# EAGLE design BC840M (EAGLE 9.6.2)

## Sheet 1 of 3
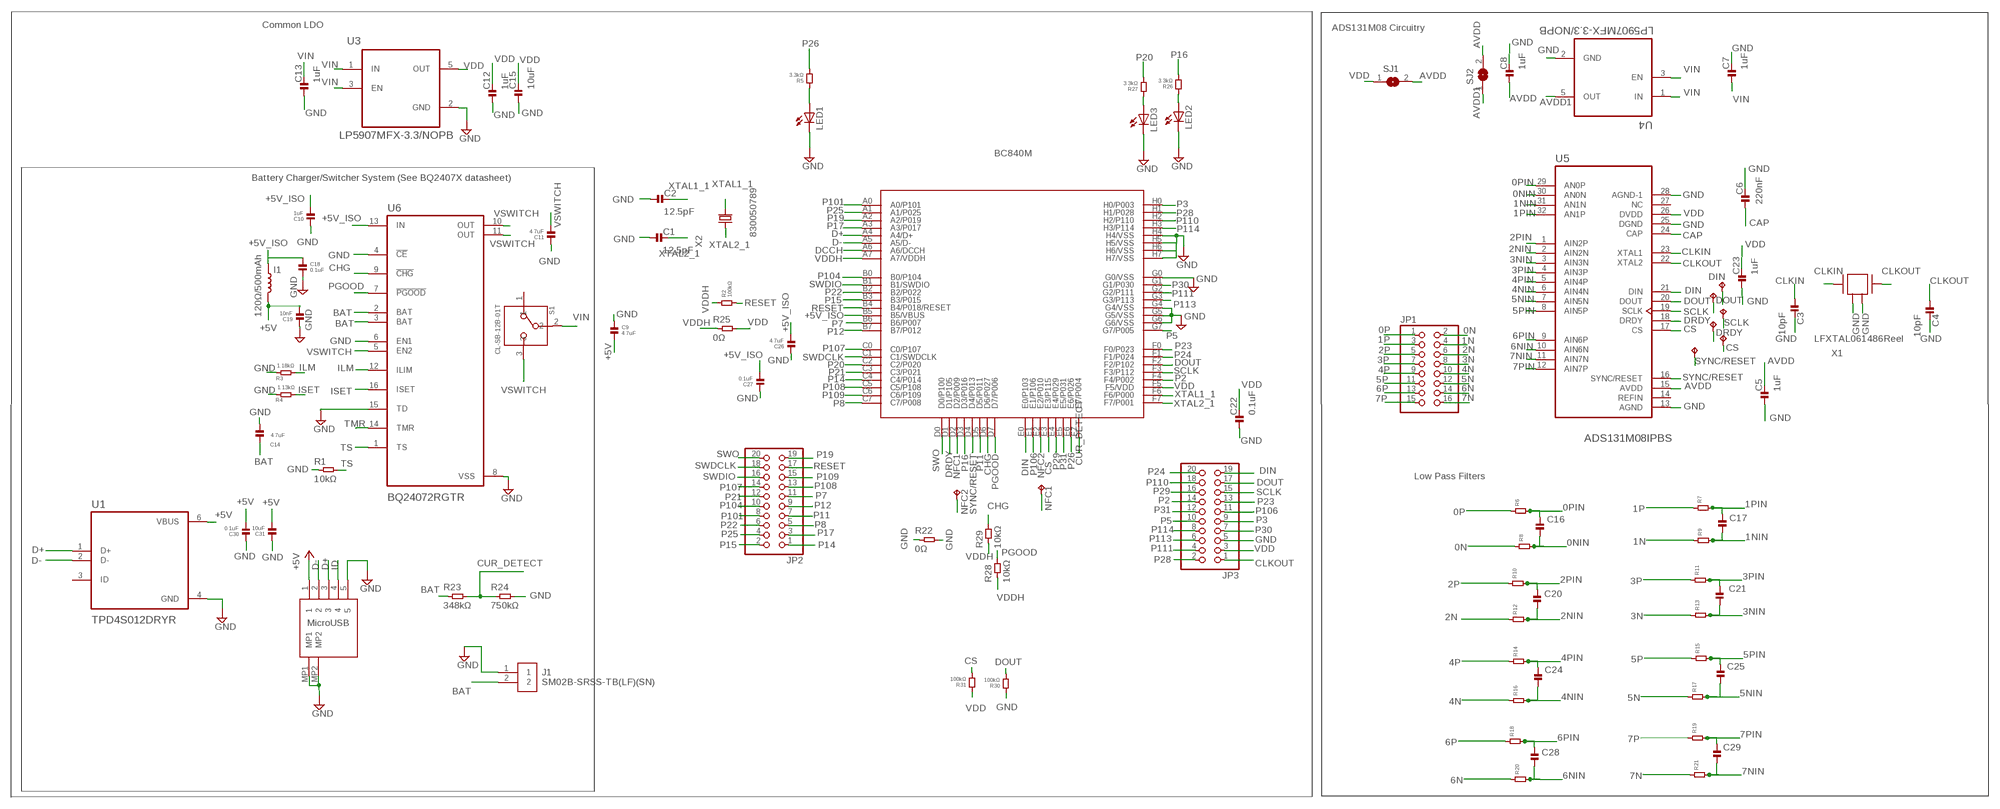
[diagram p0: schematic, sheet 1]

### Parts
C1  12.5pF  CAPACITOR.0201  [0201]
C2  12.5pF  CAPACITOR.0201  [0201]
C3  10pF  CAPACITOR.0201  [0201]
C4  10pF  CAPACITOR.0201  [0201]
C5  1uF  CAPACITOR.0201  [0201]
C6  220nF  CAPACITOR.0201  [0201]
C7  1uF  CAPACITOR.0201  [0201]
C8  1uF  CAPACITOR.0201  [0201]
C9  4.7uF  CAPACITOR.0201  [0201]
C10  1uF  CAPACITOR.0201  [0201]
C11  4.7uF  CAPACITOR.0201  [0201]
C12  1uF  CAPACITOR.0201  [0201]
C13  1uF  CAPACITOR.0201  [0201]
C14  4.7uF  CAPACITOR.0201  [0201]
C15  10uF  CAPACITOR.0402  [0402]
C16  100pF  CAPACITOR.0603  [0603]
C17  100pF  CAPACITOR.0603  [0603]
C18  0.1uF  CAPACITOR.0201  [0201]
C19  10nF  CAPACITOR.0201  [0201]
C20  100pF  CAPACITOR.0603  [0603]
C21  100pF  CAPACITOR.0603  [0603]
C22  0.1uF  CAPACITOR.0201  [0201]
C23  1uF  CAPACITOR.0201  [0201]
C24  100pF  CAPACITOR.0603  [0603]
C25  100pF  CAPACITOR.0603  [0603]
C26  4.7uF  CAPACITOR.0201  [0201]
C27  0.1uF  CAPACITOR.0201  [0201]
C28  100pF  CAPACITOR.0603  [0603]
C29  100pF  CAPACITOR.0603  [0603]
C30  0.1uF  CAPACITOR.0201  [0201]
C31  10uF  CAPACITOR.0402  [0402]
CS  TPTP07R  [TP07R]
DIN  TPTP07R  [TP07R]
DOUT  TPTP07R  [TP07R]
DRDY  TPTP07R  [TP07R]
I1  120Ω/500mAh  12NH-0402  [0402_COILCRAFT]
J1  SM02B-SRSS-TB(LF)(SN)  [SM02B-SRSS-TB(LF)(SN)]
JP1  PINHD-2X8SMT  [2X08_SMT]
JP2  PINHD-2X10SMT  [2X10_SMT]
JP3  PINHD-2X10SMT  [2X10_SMT]
LED1  LEDCHIPLED_0603  [CHIPLED_0603]
LED2  LEDCHIPLED_0603  [CHIPLED_0603]
LED3  LEDCHIPLED_0603  [CHIPLED_0603]
NFC1  TPTP14SQ  [TP14SQ]
NFC2  TPTP14SQ  [TP14SQ]
R1  10kΩ  RESISTOR.0201  [0201]
R2  100kΩ  RESISTOR.0201  [0201]
R3  1.18kΩ  RESISTOR.0603  [0603]
R4  1.13kΩ  RESISTOR.0603  [0603]
R5  3.3kΩ  RESISTOR.0201  [0201]
R6  1MOhm  RESISTOR.0603  [0603]
R7  1MOhm  RESISTOR.0603  [0603]
R8  1MOhm  RESISTOR.0603  [0603]
R9  1MOhm  RESISTOR.0603  [0603]
R10  1MOhm  RESISTOR.0603  [0603]
R11  1MOhm  RESISTOR.0603  [0603]
R12  1MOhm  RESISTOR.0603  [0603]
R13  1MOhm  RESISTOR.0603  [0603]
R14  1MOhm  RESISTOR.0603  [0603]
R15  1MOhm  RESISTOR.0603  [0603]
R16  1MOhm  RESISTOR.0603  [0603]
R17  1MOhm  RESISTOR.0603  [0603]
R18  1MOhm  RESISTOR.0603  [0603]
R19  1MOhm  RESISTOR.0603  [0603]
R20  1MOhm  RESISTOR.0603  [0603]
R21  1MOhm  RESISTOR.0603  [0603]
R22  0Ω  RESISTOR.0805  [0805]
R23  348kΩ  RESISTOR.0603  [0603]
R24  750kΩ  RESISTOR.0603  [0603]
R25  0Ω  RESISTOR.0805  [0805]
R26  3.3kΩ  RESISTOR.0201  [0201]
R27  3.3kΩ  RESISTOR.0201  [0201]
R28  10kΩ  RESISTOR.0402  [0402]
R29  10kΩ  RESISTOR.0402  [0402]
R30  100kΩ  RESISTOR.0402  [0402]
R31  100kΩ  RESISTOR.0402  [0402]
S1  CL-SB-12B-01T  [CL-SB-12B]
SCLK  TPTP07R  [TP07R]
SJ1  SJ  [SJ]
SJ2  SJ  [SJ]
SYNC  TPTP07R  [TP07R]
U1  TPD4S012DRYR  [PSON50P145X100X60-6N]
U2  BC840M  [BC840M]
U3  LP5907MFX-3.3/NOPB  [SOT95P280X145-5N]
U4  LP5907MFX-3.3/NOPB  [SOT95P280X145-5N]
U5  ADS131M08IPBS  [QFP50P700X700X120-32N]
U6  BQ24072RGTR  [QFN50P300X300X100-17N]
U7  DX4R005JJ2R1800  [DX4R005JJ2R1800]
X1  ABM3B-8.000MHZ-B2-T  [ABM3B-8.000MHZ-B2-T]
X2  FC-12M  [FC-12M]

### Nets
0N: JP1.2 R8.1
0NIN: C16.2 R8.2 U5.30(AN0N)
0P: JP1.1 R6.1
0PIN: C16.1 R6.2 U5.29(AN0P)
1N: JP1.4 R9.1
1NIN: C17.2 R9.2 U5.31(AN1N)
1P: JP1.3 R7.1
1PIN: C17.1 R7.2 U5.32(AN1P)
2N: JP1.6 R12.1
2NIN: C20.2 R12.2 U5.2(AIN2N)
2P: JP1.5 R10.1
2PIN: C20.1 R10.2 U5.1(AIN2P)
3N: JP1.8 R13.1
3NIN: C21.2 R13.2 U5.3(AIN3N)
3P: JP1.7 R11.1
3PIN: C21.1 R11.2 U5.4(AIN3P)
4N: JP1.10 R16.1
4NIN: C24.2 R16.2 U5.6(AIN4N)
4P: JP1.9 R14.1
4PIN: C24.1 R14.2 U5.5(AIN4P)
5N: JP1.12 R17.1
5NIN: C25.2 R17.2 U5.7(AIN5N)
5P: JP1.11 R15.1
5PIN: C25.1 R15.2 U5.8(AIN5P)
6N: JP1.14 R20.1
6NIN: C28.2 R20.2 U5.10(AIN6N)
6P: JP1.13 R18.1
6PIN: C28.1 R18.2 U5.9(AIN6P)
7N: JP1.16 R21.1
7NIN: C29.2 R21.2 U5.11(AIN7N)
7P: JP1.15 R19.1
7PIN: C29.1 R19.2 U5.12(AIN7P)
+5V: C9.2 C19.2 C30.2 C31.2 I1.P$2 U1.6(VBUS) U7.1
+5V_ISO: C10.2 C18.1 C26.2 C27.2 I1.P$1 U2.B5(B5/VBUS) U6.13(IN)
AVDD: C5.2 C8.1 SJ1.2 SJ2.2 U5.15(AVDD)
AVDD1: SJ2.1 U4.5(OUT)
BAT: C14.2 J1.2 R23.1 U6.2(BAT) U6.3(BAT)
CAP: C6.1 U5.24(CAP)
CHG: R29.2 U2.D6(D6/P027) U6.9(!CHG)
CLKIN: C3.1 U5.23(XTAL1) X1.1
CLKOUT: C4.1 JP3.1 U5.22(XTAL2) X1.3
CS: CS.TP R31.1 U2.E3(E3/P115) U5.17(CS)
CUR_DETECT: R23.2 R24.1 U2.E7(E7/P004)
D+: U1.1(D+) U2.A4(A4/D+) U7.3
D-: U1.2(D-) U2.A5(A5/D-) U7.2
DCCH: U2.A6(A6/DCCH)
DIN: DIN.TP JP3.19 U2.E0(E0/P103) U5.21(DIN)
DOUT: DOUT.TP JP3.17 R30.1 U2.F2(F2/P102) U5.20(DOUT)
DRDY: DRDY.TP U2.D1(D1/P105) U5.18(DRDY)
GND: C1.1 C2.1 C3.2 C4.2 C5.1 C6.2 C7.2 C8.2 C9.1 C10.1 C11.1 C12.1 C13.1 C14.1 C15.1 C18.2 C19.1 C22.1 C23.1 C26.1 C27.1 C30.1 C31.1 J1.1 JP3.5 LED1.C LED2.C LED3.C R1.1 R3.1 R4.1 R22.1 R22.2 R24.2 R30.2 U1.4(GND) U2.G0(G0/VSS) U2.G4(G4/VSS) U2.G5(G5/VSS) U2.G6(G6/VSS) U2.H4(H4/VSS) U2.H5(H5/VSS) U2.H6(H6/VSS) U2.H7(H7/VSS) U3.2(GND) U4.2(GND) U5.13(AGND) U5.25(DGND) U5.28(AGND-1) U6.4(!CE) U6.6(EN1) U6.8(VSS) U6.15(TD) U7.5 U7.MP1 U7.MP2 X1.2 X1.4
ID: U7.4
ILM: R3.2 U6.12(ILIM)
ISET: R4.2 U6.16(ISET)
LED1: LED1.A R5.2
LED2: LED2.A R26.2
LED3: LED3.A R27.2
NFC1: NFC2.TP U2.D2(D2/P009)
NFC2: NFC1.TP U2.E2(E2/P010)
P2: JP3.14 U2.F4(F4/P002)
P3: JP3.9 U2.H0(H0/P003)
P5: JP3.10 U2.G7(G7/P005)
P7: JP2.11 U2.B6(B6/P007)
P8: JP2.5 U2.C7(C7/P008)
P11: JP2.7 U2.D5(D5/P011)
P12: JP2.9 U2.B7(B7/P012)
P14: JP2.1 U2.C4(C4/P014)
P15: JP2.2 U2.B3(B3/P015)
P16: R26.1 U2.D3(D3/P016)
P17: JP2.3 U2.A3(A3/P017)
P19: JP2.19 U2.A2(A2/P019)
P20: R27.1 U2.C2(C2/P020)
P21: JP2.12 U2.C3(C3/P021)
P22: JP2.6 U2.B2(B2/P022)
P23: JP3.13 U2.F0(F0/P023)
P24: JP3.20 U2.F1(F1/P024)
P25: JP2.4 U2.A1(A1/P025)
P26: R5.1 U2.E6(E6/P026)
P28: JP3.2 U2.H1(H1/P028)
P29: JP3.16 U2.E4(E4/P029)
P30: JP3.7 U2.G1(G1/P030)
P31: JP3.12 U2.E5(E5/P031)
P101: JP2.8 U2.A0(A0/P101)
P104: JP2.10 U2.B0(B0/P104)
P106: JP3.11 U2.E1(E1/P106)
P107: JP2.14 U2.C0(C0/P107)
P108: JP2.13 U2.C5(C5/P108)
P109: JP2.15 U2.C6(C6/P109)
P110: JP3.18 U2.H2(H2/P110)
P111: JP3.4 U2.G2(G2/P111)
P113: JP3.6 U2.G3(G3/P113)
P114: JP3.8 U2.H3(H3/P114)
PGOOD: R28.2 U2.D7(D7/P006) U6.7(!PGOOD)
RESET: JP2.17 R2.1 U2.B4(B4/P018/RESET)
SCLK: JP3.15 SCLK.TP U2.F3(F3/P112) U5.19(SCLK)
SWDCLK: JP2.18 U2.C1(C1/SWDCLK)
SWDIO: JP2.16 U2.B1(B1/SWDIO)
SWO: JP2.20 U2.D0(D0/P100)
SYNC/RESET: SYNC.TP U2.D4(D4/P013) U5.16(SYNC/RESET)
TMR: U6.14(TMR)
TS: R1.2 U6.1(TS)
VDD: C12.2 C15.2 C22.2 C23.2 JP3.3 R25.2 R31.2 SJ1.1 U2.F5(F5/VDD) U3.5(OUT) U5.26(DVDD)
VDDH: R2.2 R25.1 R28.1 R29.1 U2.A7(A7/VDDH)
VIN: C7.1 C13.2 S1.2 U3.1(IN) U3.3(EN) U4.1(IN) U4.3(EN)
VSWITCH: C11.2 S1.3 U6.5(EN2) U6.10(OUT) U6.11(OUT)
XTAL1_1: C2.2 U2.F6(F6/P000) X2.2
XTAL2_1: C1.2 U2.F7(F7/P001) X2.1
Unconnected: S1.1 U1.3(ID) U5.14(REFIN) U5.27(NC)

### Notes on the sheet
- Common LDO
- ADS131M08 Circuitry
- BC840M
- Battery Charger/Switcher System (See BQ2407X datasheet)
- 830050789
- LFXTAL061486Reel
- Low Pass Filters
- MicroUSB

## Sheet 2 of 3

## Sheet 3 of 3

## Library data of the parts
C1-C31 = standardparts:CAPACITOR
CS DIN DOUT DRDY NFC1 NFC2 SCLK SYNC = testpad:TP: Test pad
I1 = spkfncoils:12NH; MOUSER_PART: 994-0402HP-12NXGLU; PROD_ID: NDUC-15271; VALUE: 12nH
J1 = SM02B-SRSS-TB_LF__SN_:SM02B-SRSS-TB(LF)(SN): JST (JAPAN SOLDERLESS TERMINALS) - SM02B-SRSS-TB (LF)(SN) - HEADER, R/A, 2WAY Source: Datasheet <http://www.jst-mfg.com/product/pdf/eng/eSH.pdf> Check prices <https://pricing.snapeda.com/parts/SM02B-SRSS-TB%28LF%29%28SN%29/JST%20Sales/view-part?ref=eda>; AVAILABILITY: In Stock; DESCRIPTION: Connector Header Surface Mount, Right Angle 2 position 0.039 (1.00mm); MF: JST Sales; MP: SM02B-SRSS-TB(LF)(SN); PACKAGE: None; PRICE: None
JP1 = pinhead+:PINHD-2X8: PIN HEADER
JP2 JP3 = pinhead+:PINHD-2X10: PIN HEADER
LED1-LED3 = adafruit:LED: LED OSRAM: - CHIPLED LG R971, LG N971, LY N971, LG Q971, LY Q971, LO R971, LY R971 LH N974, LH R974 LS Q976, LO Q976, LY Q976 LO Q996 - Hyper CHIPLED LW Q18S LB Q993, LB Q99A, LB R99A - SideLED LS A670, LO A670, LY A670, LG A670, LP A670 LB A673, LV A673, LT A673, LW A673 LH A674 LY A675 LS A676, LA A676, LO A676, LY A676, LW A676 LS A679, LY A679, LG A679 - Hyper Micro SIDELED® LS Y876, LA Y876, LO Y876, LY Y876 LT Y87S - SmartLED LW L88C, LW L88S LB L89C, LB L89S, LG L890 LS L89K, LO L89K, LY L89K LS L896, LA L896, LO L896, LY L896 - TOPLED LS T670, LO T670, LY T670, LG T670, LP T670 LSG T670, LSP T670, LSY T670, LOP T670, LYG T670 LG T671, LOG T671, LSG T671 LB T673, LV T673, LT T673, LW T673 LH T674 LS T676, LA T676, LO T676, LY T676, LB T676, LH T676, LSB T676, LW T676 LB T67C, LV T67C, LT T67C, LS T67K, LO T67K, LY T67K, LW E67C LS E67B, LA E67B, LO E67B, LY E67B, LB E67C, LV E67C, LT E67C LW T67C LS T679, LY T679, LG T679 LS T770, LO T770, LY T770, LG T770, LP T770 LB T773, LV T773, LT T773, LW T773 LH T774 LS E675, LA E675, LY E675, LS T675 LS T776, LA T776, LO T776, LY T776, LB T776 LHGB T686 LT T68C, LB T68C - Hyper Mini TOPLED® LB M676 - Mini TOPLED Santana® LG M470 LS M47K, LO M47K, LY M47K Source: http://www.osram.convergy.de/
R1 R2 R4-R31 = standardparts:RESISTOR
R3 = standardparts:RESISTOR; SPICEPREFIX: R
S1 = CL-SB-12B-01T:CL-SB-12B-01T: Check prices <https://pricing.snapeda.com/parts/CL-SB-12B-01T/Nidec%20Copal/view-part?ref=eda>; AVAILABILITY: In Stock; DESCRIPTION: Slide Switch SPDT Surface Mount; MF: Nidec Copal; MP: CL-SB-12B-01T; PACKAGE: None; PRICE: None
SJ1 SJ2 = jumper:SJ: SMD solder JUMPER
U1 = TPD4S012DRYR:TPD4S012DRYR: Check prices <https://pricing.snapeda.com/parts/TPD4S012DRYR/Texas%20Instruments/view-part?ref=eda>; AVAILABILITY: In Stock; DESCRIPTION: 4-channel USB ESD solution with power clamp 6-SON -40 to 85; MF: Texas Instruments; MP: TPD4S012DRYR; PACKAGE: USON-6 Texas Instruments; PRICE: None; PURCHASE-URL: https://pricing.snapeda.com/search/part/TPD4S012DRYR/?ref=eda
U2 = BC840M:BC840M: Check prices <https://pricing.snapeda.com/parts/BC840M/Fanstel%20Corp./view-part?ref=eda>; AVAILABILITY: In Stock; DESCRIPTION: 802.15.4, Bluetooth Bluetooth v5.0, Thread, Zigbee® Transceiver Module 2.4GHz PCB Trace Surface Mount; MF: Fanstel Corp.; MP: BC840M; PACKAGE: None; PRICE: None; PURCHASE-URL: https://pricing.snapeda.com/search/part/BC840M/?ref=eda
U3 U4 = LP5907MFX-3.3_NOPB:LP5907MFX-3.3/NOPB: IC REG LINEAR 3.3V 250MA SOT23; AVAILABILITY: Unavailable; DESCRIPTION: Linear Voltage Regulator IC 1 Output 250mA SOT-23-5; MF: Texas Instruments; MP: LP5907MFX-3.3/NOPB; PACKAGE: SOT-23 Texas Instruments; PRICE: None
U5 = ADS131M08IPBS:ADS131M08IPBS: None Check prices <https://pricing.snapeda.com/parts/ADS131M08IPBS/Texas%20Instruments/view-part?ref=eda>; AVAILABILITY: Warning; DESCRIPTION: 24-bit 32-kSPS 8-channelsimultaneous-sampling delta-sigma ADC 32-TQFP -40 to 125; MF: Texas Instruments; MP: ADS131M08IPBS; PACKAGE: TQFP-32 Texas Instruments; PRICE: None; PURCHASE-URL: https://pricing.snapeda.com/search/part/ADS131M08IPBS/?ref=eda
U6 = BQ24072RGTR:BQ24072RGTR: Check prices <https://pricing.snapeda.com/parts/BQ24072RGTR/Texas%20Instruments/view-part?ref=eda>; AVAILABILITY: In Stock; DESCRIPTION: Standalone 1-cell 1.5-A linear charger, Power Path, 4.2-V VBAT and VOUT=VBAT + 225mV 16-VQFN -40 to 85; MF: Texas Instruments; MP: BQ24072RGTR; PACKAGE: VQFN-16 Texas Instruments; PRICE: None; PURCHASE-URL: https://pricing.snapeda.com/search/part/BQ24072RGTR/?ref=eda
U7 = DX4R005JJ2R1800:DX4R005JJ2R1800: Check prices <https://pricing.snapeda.com/parts/DX4R005JJ2R1800/JAE%20Electronics/view-part?ref=eda>; AVAILABILITY: In Stock; DESCRIPTION: USB - micro B USB 2.0 Receptacle Connector 5 Position Surface Mount, Right Angle; Through Hole; MF: JAE Electronics; MP: DX4R005JJ2R1800; PACKAGE: None; PRICE: None
X1 = Crystals_Oscillators:ABM3B-8.000MHZ-B2-T: CRYSTAL 8.0000MHZ 18PF SMD Manufacturer's datasheet <https://abracon.com/Resonators/abm3b.pdf>; CREATED_BY: PCBLayout.com; DIGIKEY_PART_NUMBER: 535-9720-2-ND; MANUFACTURER: Abracon LLC; MPN: ABM3B-8.000MHZ-B2-T; PACKAGE: SMD 4
X2 = crystal:FC-12M: kHz RANGE CRYSTAL UNIT LOW PROFILE SMD Source: Epson Toyocom FC-12M.pdf

## Board
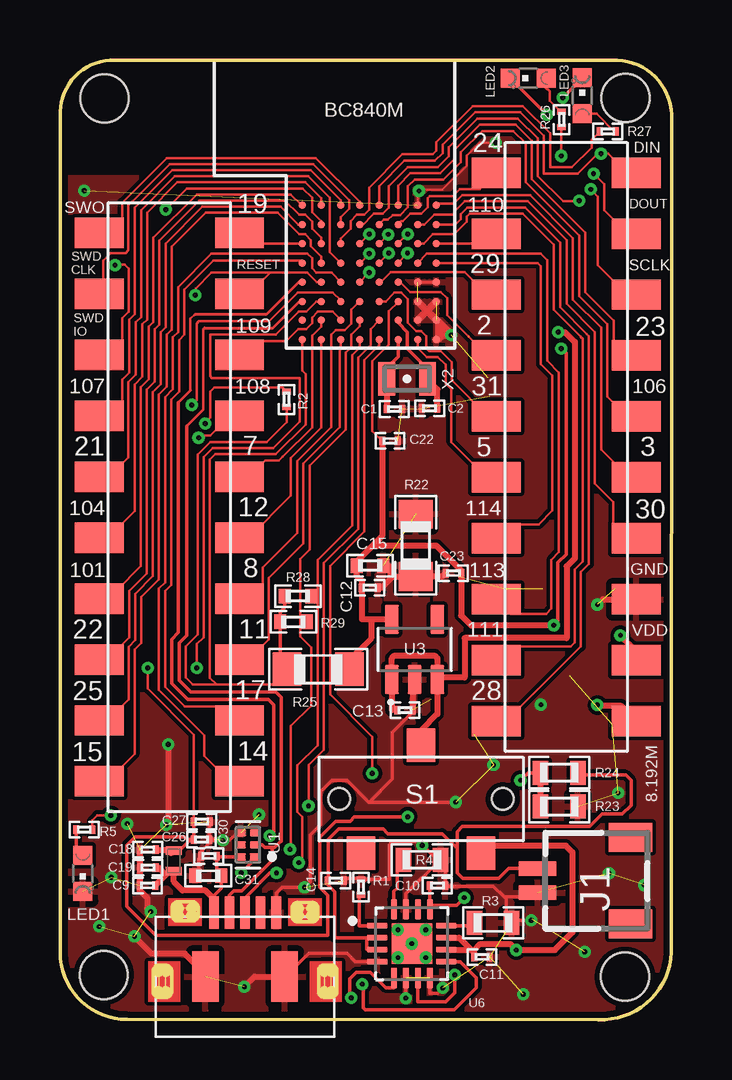
[diagram p1: board, top side]
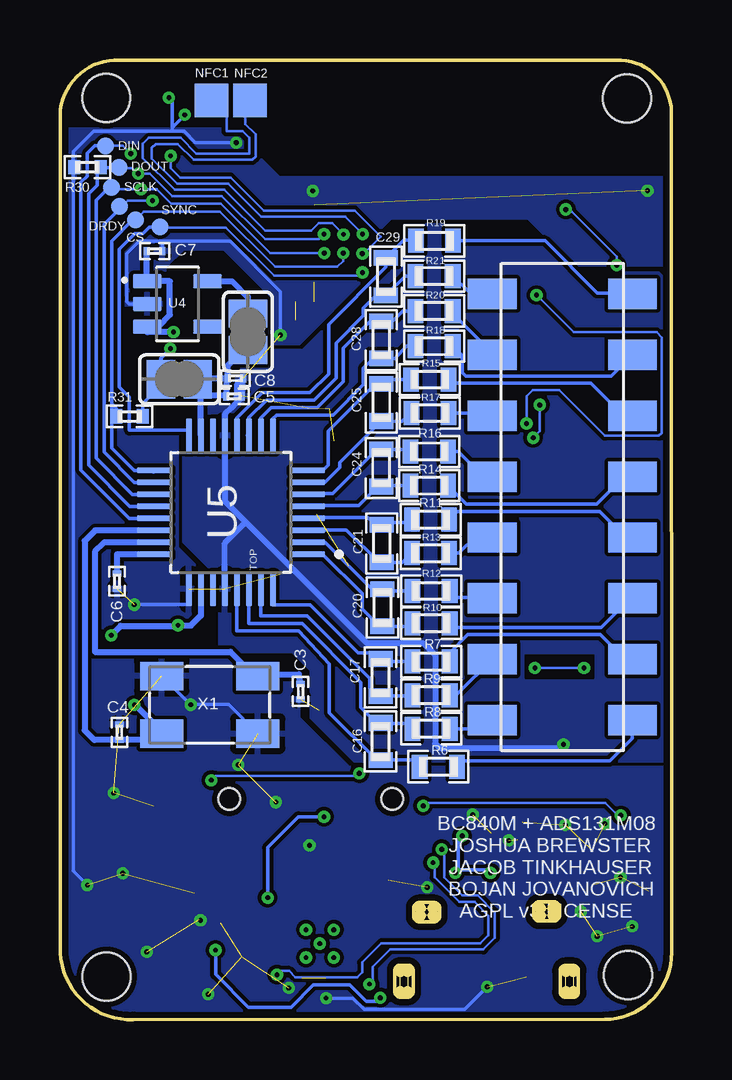
[diagram p2: board, bottom side, seen from below]

Size 25.49 x 40 mm. Coordinates in mm from the lower left corner, seen from the top.
Outline: 0,2.8 0.01,37.84 arc-90 2.3,40 23,40 arc-90 25.49,37.71 25.48,2.79 arc-90 22.43,0 2.79,0 arc-90 0,2.8
Outline: 3.89,2.03 arc-90 4.12,2.26 4.42,2.26 arc-90 4.65,2.03 4.65,1.15 arc-90 4.42,0.92 4.12,0.92 arc-90 3.89,1.15 3.89,2.03
Outline: 10.78,2.04 arc-90 11,2.27 11.31,2.27 arc-90 11.54,2.04 11.54,1.16 arc-90 11.31,0.93 11,0.93 arc-90 10.78,1.16 10.78,2.04
Outline: 4.91,4.11 arc-90 4.68,4.34 4.68,4.68 arc-90 4.91,4.91 5.52,4.91 arc-90 5.75,4.68 5.75,4.34 arc-90 5.52,4.11 4.91,4.11
Outline: 9.9,4.08 arc-90 9.67,4.31 9.67,4.65 arc-90 9.9,4.88 10.52,4.88 arc-90 10.74,4.65 10.74,4.31 arc-90 10.52,4.08 9.9,4.08
Copper layers (1*16): Top 0.035mm / dielectric 1.5mm / Bottom 0.035mm
Design rules "default *": minimum track width 4mil, minimum drill 0.2mm, track to track 6mil, track to pad 6mil, pad to pad 6mil, via to via 6mil, smd to smd 6mil, copper to edge 10mil, drill to drill 6mil, minimum pad ring 6mil, minimum via ring 6mil, stop-mask expansion 4mil, vias tented up to drill 20mil, thermal gap 10mil
Holes 2 mm at 1.86,38.4 23.56,38.42 1.82,1.86 23.54,1.79

### Footprints (pad centres in the part's own frame; a part is rotated, then mirrored left to right if it is on the bottom)
0201 = smd 0.25 x 0.35: 1 -0.325,0; 2 0.325,0
0402 = smd 0.5 x 0.6: 1 -0.55,0; 2 0.55,0
0603 = smd 0.65 x 1: 1 -0.775,0; 2 0.775,0
TP07R = smd 0.7 x 0.7: TP 0,0
0402_COILCRAFT = smd 0.356 x 0.66: P$1 -0.432,0; P$2 0.432,0
SM02B-SRSS-TB(LF)(SN) = smd 0.6 x 1.55: 1 -0.5,1.975; 2 0.5,1.975 | smd 1.2 x 1.8: 3 -1.8,-1.9; 4 1.8,-1.9
2X08_SMT = smd 1.27 x 2.032: 1 -8.89,-2.921; 2 -8.89,2.921; 3 -6.35,-2.921; 4 -6.35,2.921; 5 -3.81,-2.921; 6 -3.81,2.921; 7 -1.27,-2.921; 8 -1.27,2.921; 9 1.27,-2.921; 10 1.27,2.921; 11 3.81,-2.921; 12 3.81,2.921; 13 6.35,-2.921; 14 6.35,2.921; 15 8.89,-2.921; 16 8.89,2.921
2X10_SMT = smd 1.27 x 2.032: 1 -11.43,-2.921; 2 -11.43,2.921; 3 -8.89,-2.921; 4 -8.89,2.921; 5 -6.35,-2.921; 6 -6.35,2.921; 7 -3.81,-2.921; 8 -3.81,2.921; 9 -1.27,-2.921; 10 -1.27,2.921; 11 1.27,-2.921; 12 1.27,2.921; 13 3.81,-2.921; 14 3.81,2.921; 15 6.35,-2.921; 16 6.35,2.921; 17 8.89,-2.921; 18 8.89,2.921; 19 11.43,-2.921; 20 11.43,2.921
CHIPLED_0603 = smd 0.8 x 0.8: A 0,-0.75; C 0,0.75
TP14SQ = smd 1.4 x 1.4: TP 0,0
0805 = smd 1.2 x 1.4: 1 -1.3,0; 2 1.3,0
CL-SB-12B = smd 1.2 x 1.4: 1 -2.5,-2.25; 2 0,2.25; 3 2.5,-2.25 | hole 0.9: 3.4,0; -3.4,0
SJ = smd 1.168 x 1.6: 1 -0.762,0; 2 0.762,0
PSON50P145X100X60-6N = smd 0.42 x 0.3: 1 -0.29,0.5 | smd 0.41 x 0.3: 2 -0.295,0; 3 -0.295,-0.5; 4 0.295,-0.5; 5 0.295,0; 6 0.295,0.5
BC840M = smd 0.305 x 0.305: A0 0.66,5.966; A1 0.66,5.153; A2 0.66,4.366; A3 0.66,3.553; A4 0.66,2.765; A5 0.66,1.953; A6 0.66,1.165; A7 0.66,0.352; B0 1.448,5.966; B1 1.448,5.153; B2 1.448,4.366; B3 1.448,3.553; B4 1.448,2.765; B5 1.448,1.953; B6 1.448,1.165; B7 1.448,0.352; C0 2.261,5.966; C1 2.261,5.153; C2 2.261,4.366; C3 2.261,3.553; C4 2.261,2.765; C5 2.261,1.953; C6 2.261,1.165; C7 2.261,0.352; D0 3.048,5.966; D1 3.048,5.153; D2 3.048,4.366; D3 3.048,3.553; D4 3.048,2.765; D5 3.048,1.953; D6 3.048,1.165; D7 3.048,0.352; E0 3.861,5.966; E1 3.861,5.153; E2 3.861,4.366; E3 3.861,3.553; E4 3.861,2.765; E5 3.861,1.953; E6 3.861,1.165; E7 3.861,0.352; F0 4.648,5.966; F1 4.648,5.153; F2 4.648,4.366; F3 4.648,3.553; F4 4.648,2.765; F5 4.648,1.953; F6 4.648,1.165; F7 4.648,0.352; G0 5.461,5.966; G1 5.461,5.153; G2 5.461,4.366; G3 5.461,3.553; G4 5.461,2.765; G5 5.461,1.953; G6 5.461,1.165; G7 5.461,0.352; H0 6.248,5.966; H1 6.248,5.153; H2 6.248,4.366; H3 6.248,3.553; H4 6.248,2.765; H5 6.248,1.953; H6 6.248,1.165; H7 6.248,0.352
SOT95P280X145-5N = smd 1.21 x 0.59: 1 -1.255,0.95; 2 -1.255,0; 3 -1.255,-0.95; 4 1.255,-0.95; 5 1.255,0.95
QFP50P700X700X120-32N = smd 1.44 x 0.26: 1 -3.195,1.75; 2 -3.195,1.25; 3 -3.195,0.75; 4 -3.195,0.25; 5 -3.195,-0.25; 6 -3.195,-0.75; 7 -3.195,-1.25; 8 -3.195,-1.75; 17 3.195,-1.75; 18 3.195,-1.25; 19 3.195,-0.75; 20 3.195,-0.25; 21 3.195,0.25; 22 3.195,0.75; 23 3.195,1.25; 24 3.195,1.75 | smd 0.26 x 1.44: 9 -1.75,-3.195; 10 -1.25,-3.195; 11 -0.75,-3.195; 12 -0.25,-3.195; 13 0.25,-3.195; 14 0.75,-3.195; 15 1.25,-3.195; 16 1.75,-3.195; 25 1.75,3.195; 26 1.25,3.195; 27 0.75,3.195; 28 0.25,3.195; 29 -0.25,3.195; 30 -0.75,3.195; 31 -1.25,3.195; 32 -1.75,3.195
QFN50P300X300X100-17N = smd 0.86 x 0.26: 1 -1.435,0.75; 2 -1.435,0.25; 3 -1.435,-0.25; 4 -1.435,-0.75; 9 1.435,-0.75; 10 1.435,-0.25; 11 1.435,0.25; 12 1.435,0.75 | smd 0.26 x 0.86: 5 -0.75,-1.435; 6 -0.25,-1.435; 7 0.25,-1.435; 8 0.75,-1.435; 13 0.75,1.435; 14 0.25,1.435; 15 -0.25,1.435; 16 -0.75,1.435 | smd 1.68 x 1.68: 17 0,0 | drill 0.2 pad 0.4: 18 0,0; 19 -0.58,0.58; 20 0.58,0.58; 21 -0.58,-0.58; 22 0.58,-0.58
DX4R005JJ2R1800 = smd 1.35 x 0.4: 1 1.525,1.3; 2 1.525,0.65; 3 1.525,0; 4 1.525,-0.65; 5 1.525,-1.3 | smd 2.1 x 1.1: MP1 -1.15,1.65; MP2 -1.15,-1.65
ABM3B-8.000MHZ-B2-T = smd 1.8 x 1.2: 1 -2,-1.2; 2 2,-1.2; 3 2,1.2; 4 -2,1.2
FC-12M = smd 0.7 x 1.4: 1 -0.85,0; 2 0.85,0

### Placement (x,y rotation side)
C1  13.93,25.45 180 top
C2  15.4,25.48 0 top
C3  15.46,13.68 270 bottom
C4  23.01,11.98 90 bottom
C5  18.23,25.98 180 bottom
C6  23.11,18.27 270 bottom
C7  21.54,32.03 0 bottom
C8  18.18,26.74 0 bottom
C9  3.64,5.59 0 top
C10  15.72,5.58 180 top
C11  17.58,2.61 180 top
C12  12.91,18.01 180 top
C13  14.38,12.9 180 top
C14  11.49,5.8 180 top
C15  12.92,18.93 180 top
C16  12.13,11.59 90 bottom
C17  12.13,14.26 270 bottom
C18  3.66,7.08 180 top
C19  3.66,6.34 0 top
C20  12.05,17.17 90 bottom
C21  12.08,19.85 270 bottom
C22  13.75,24.12 180 top
C23  16.39,18.61 0 top
C24  12.11,23 90 bottom
C25  12.1,25.73 270 bottom
C26  5.9,7.5 180 top
C27  5.91,8.25 180 top
C28  12.1,28.33 90 bottom
C29  11.91,30.97 270 bottom
C30  6.2,6.82 0 top
C31  6.18,6 0 top
CS  22.34,33.34 0 bottom
DIN  23.59,36.42 0 bottom
DOUT  23.04,35.52 0 bottom
DRDY  23.01,33.9 0 bottom
I1  4.74,6.61 270 top
J1  21.87,5.79 90 top
JP1  4.56,21.37 90 bottom
JP2  4.55,21.36 90 top
JP3  21.09,23.87 90 top
LED1  0.95,6.09 180 top
LED2  19.5,39.25 90 top
LED3  21.76,38.52 0 top
NFC1  19.18,38.32 0 bottom
NFC2  17.57,38.32 0 bottom
R1  12.55,5.53 270 top
R2  9.44,25.85 270 top
R3  18.04,4.03 180 top
R4  15.08,6.66 180 top
R5  1.01,7.92 180 top
R6  9.73,10.54 180 bottom
R7  10.03,14.92 180 bottom
R8  10.03,12.13 180 bottom
R9  10.03,13.52 180 bottom
R10  10.03,16.52 180 bottom
R11  10.05,20.84 180 bottom
R12  10.03,17.87 180 bottom
R13  10.05,19.44 180 bottom
R14  10.1,22.26 180 bottom
R15  10.08,26.68 180 bottom
R16  10.1,23.68 180 bottom
R17  10.07,25.29 180 bottom
R18  9.9,28.07 180 bottom
R19  9.89,32.46 180 bottom
R20  9.9,29.54 180 bottom
R21  9.9,31 180 bottom
R22  14.82,19.77 90 top
R23  20.8,10.29 180 top
R24  20.8,8.88 0 top
R25  10.76,14.6 0 top
R26  20.9,37.52 90 top
R27  22.82,37.02 0 top
R28  9.92,17.65 0 top
R29  9.72,16.58 0 top
R30  24.35,35.53 180 bottom
R31  22.59,25.14 0 bottom
S1  15.04,9.19 0 top
SCLK  23.35,34.7 0 bottom
SJ1  20.52,26.7 0 bottom
SJ2  17.66,28.67 270 bottom
SYNC  21.32,33.04 0 bottom
U1  7.83,7.28 180 top
U2  9.44,27.99 0 top
U3  14.78,15.43 90 top
U4  20.6,29.83 0 bottom
U5  18.37,21.14 180 bottom
U6  14.66,3.17 0 top
U7  7.71,2.94 90 top
X1  19.25,13.12 180 bottom
X2  14.47,26.72 0 top

### Tracks (layer width: path | path; a pad name or v marks a point on that pad's centre or on a via)
0N
  Bottom 0.152: R8.1 7.83,12.13 JP1.2
0NIN
  Bottom 0.152: U5.30 17.62,16.5 15.41,16.5 12.95,14.05 12.95,13 12.31,12.37 C16.2 12.12,12.35 11.03,12.35 R8.2
0P
  Bottom 0.152: R6.1 8.95,10.78 2.59,10.78 1.64,11.73 JP1.1
0PIN
  Bottom 0.152: U5.29 18.12,16.2 15.54,16.2 14.26,14.82 14.26,12.79 12.29,10.82 C16.1 10.78,10.82 R6.2
1N
  Bottom 0.152: R9.1 9.19,13.59 8.91,13.59 JP1.4
1NIN
  Bottom 0.152: U5.31 17.12,16.83 15.19,16.83 12.58,14.23 12.58,13.81 12.26,13.48 C17.2 12.13,13.5 10.83,13.5 R9.2
1P
  Bottom 0.152: R7.1 9.25,15.29 8.49,16.05 2.98,16.05 1.95,15.02 JP1.3
1PIN
  Bottom 0.152: U5.32 16.62,17.28 15.06,17.28 13.06,15.28 12.38,15.28 C17.1 12.02,14.92 R7.2
2N
  Bottom 0.152: R12.1 8.98,17.6 7.52,17.6 JP1.6
2NIN
  Bottom 0.152: R12.2 11.97,17.87 C20.2 12.5,17.94 14.45,19.89 U5.2 | U5.2 | U5.2
2P
  Bottom 0.152: R10.1 9.08,16.35 2.94,16.35 1.73,17.56 JP1.5
2PIN
  Bottom 0.152: U5.1 14.53,19.39 12.9,17.76 12.9,17.12 12.18,16.39 C20.1 10.93,16.39 R10.2
3N
  Bottom 0.152: R13.1 8.87,19.44 8.17,20.14 7.52,20.14 JP1.8
3NIN
  Bottom 0.152: R13.2 11.22,19.05 12.06,19.05 C21.2 12.21,19.07 13.55,20.42 15.15,20.42 U5.3
3P
  Bottom 0.152: R11.1 8.94,21.18 3,21.18 1.92,20.1 JP1.7
3PIN
  Bottom 0.152: U5.4 15.13,20.93 12.67,20.93 12.36,20.62 C21.1 11.99,20.71 10.95,20.71 R11.2
4N
  Bottom 0.152: JP1.10 7.85,22.64 8.9,23.68 R16.1
4NIN
  Bottom 0.152: U5.6 15.13,21.93 14.12,21.93 12.29,23.77 C24.2 12.1,23.76 10.96,23.76 R16.2
4P
  Bottom 0.152: R14.1 8.55,21.49 3.12,21.49 1.97,22.64 JP1.9
4PIN
  Bottom 0.152: U5.5 15.13,21.43 13.04,21.43 12.25,22.22 C24.1 12.11,22.26 R14.2
5N
  Bottom 0.152: R17.1 7.59,25.29 JP1.12
5NIN
  Bottom 0.152: U5.7 15.15,22.42 14.43,22.42 13.83,23.02 13.83,23.22 C25.2 11.25,24.94 10.9,25.29 R17.2
5P
  Bottom 0.152: R15.1 9.15,26.53 3.37,26.53 2.02,25.18 JP1.11
5PIN
  Bottom 0.152: U5.8 14.54,22.89 14.31,23.12 14.31,24.54 12.35,26.5 C25.1 11.92,26.68 R15.2
6N
  Bottom 0.152: R20.1 9.08,29.49 9.08,29.39 7.49,27.81 7.49,27.73 JP1.14
6NIN
  Bottom 0.152: U5.10 17.12,25.07 16.68,25.51 14.77,25.51 13.68,26.6 13.68,27.99 12.56,29.11 C28.2 11.63,29.11 11.21,29.52 10.69,29.52 R20.2
6P
  Bottom 0.152: R18.1 8.72,27.67 8.72,26.97 8.59,26.83 2.52,26.83 JP1.13
6PIN
  Bottom 0.152: U5.9 16.62,25.05 16.46,25.2 14.11,25.2 12.85,26.46 12.85,27.15 12.44,27.56 C28.1 11.55,27.56 11.03,28.07 R18.2
7N
  Bottom 0.152: R21.1 8.43,30.3 7.52,30.3 JP1.16
7NIN
  Bottom 0.152: U5.11 17.62,25.09 16.88,25.83 14.9,25.83 13.98,26.74 13.98,28.21 12.85,29.35 12.85,29.67 12.32,30.19 C29.2 11.11,31 R21.2
  Bottom 0.254: U5.11
7P
  Bottom 0.152: R19.1 5.28,32.46 3.11,30.29 1.65,30.29 1.64,30.28 JP1.15
7PIN
  Bottom 0.152: U5.12 18.12,25.07 17.06,26.13 15.08,26.13 14.29,26.92 14.29,28.98 11.91,31.36 C29.1 11.16,32.5 10.7,32.5 R19.2
+5V
  Top 0.102: 6.43,4.49 U7.1
  Top 0.152: 4.73,6.17 I1.P$2 4.69,6.24 | 4.04,6.29 C19.2 | U1.6 6.56,6.78 C30.2 6.53,6.2 C31.2 6.73,5.47 6.39,5.13 6.39,5.06
  Top 0.254: U7.1 6.39,4.48 6.39,5.05 | 4.73,6.17 4.55,6.17 C9.2 4.28,5.9 4.28,6.17 4.11,6.34 C19.2 | 6.39,5.05 6.06,5.39 5.1,5.39 4.75,5.74 I1.P$2 | 6.39,5.05 6.39,5.06
+5V_ISO  (via drill 0.2)
  Top 0.102: U2.B5 10.69,29.94 10.26,29.51 9.95,29.51 8.99,28.55 6.27,28.55 6.26,28.54 6.26,26.82 6.33,26.75 9.98,26.75 9.98,24.93 8.88,23.82 6.36,23.82 5.99,23.45 5.99,15.94 5.7,15.65 v5.7,14.66 | v3.66,14.66 3.66,13.8 5.58,11.87 C27.2 | I1.P$1
  Top 0.152: v14.49,8.45 12.27,8.45 12.09,8.27 11.49,8.27 10.81,7.6 10.81,5.52 11.15,5.18 11.15,3.52 3.98,3.52 2.78,4.73 2.78,7.26 3.13,7.61 5.19,7.61 5.29,7.5 C26.2 | C18.1 | v16.84,5.08 16.53,4.77 15.41,4.77 U6.13 C10.2 | C26.2 5.44,7.5 4.99,7.05 I1.P$1 | C27.2 C26.2
  Top 0.254: C18.1 4.49,7.08 4.63,6.93 I1.P$1
  Bottom 0.102: v5.7,14.66 v3.66,14.66
  Bottom 0.152: v14.49,8.45 15.56,8.45 16.84,7.17 v16.84,5.08
AVDD
  Bottom 0.254: U5.15 19.62,26.02 18.6,26.02 C5.2 18.56,26.68 C8.1 | C8.1 18.5,26.74 | C8.1 18.5,27.25 17.85,27.91 SJ2.2 | SJ1.2 19.71,26.74 C8.1
AVDD1
  Bottom 0.254: U4.5 18.32,30.78 17.66,30.12 SJ2.1
BAT
  Top 0.152: 16.54,7.13 16.54,6.12 16.77,5.89 18.28,5.89 18.7,6.31 19.88,6.31 J1.2 | R23.1 21.68,10.19 23.57,10.19 23.8,9.96 23.8,8.93 23.43,8.57 22.59,8.57 22.08,8.06 16.77,8.06 16.54,7.83 16.54,7.13 | 16.54,7.13 15.92,7.75 13.66,7.75 13.46,7.95 11.61,7.95 11.17,7.51 C14.2 11.17,5.62 11.46,5.33 11.46,3.42 12.77,3.42 | U6.3 13.21,2.93 12.77,2.93 12.77,3.42 | U6.2 12.77,3.42
CAP
  Bottom 0.254: U5.24 23.11,19.39 C6.1
CHG  (via drill 0.2)
  Top 0.102: U2.D6 12.48,28.9 12.13,28.55 12.13,28.02 11.91,27.8 11.91,24.59 10.41,23.09 10.41,19.6 10.01,19.2 10.01,16.63 | v9.58,7.1 9.62,7.1 9.62,12.23 10.46,13.07 10.46,15.52 10.01,15.98 10.01,16.63 | R29.2 10.22,16.63 10.01,16.63
  Top 0.152: U6.9 16.67,2.42 17.34,1.75 17.34,1.33 16.42,0.41 12.71,0.41 12.63,0.5 12.63,1.45 v12.6,1.48
  Bottom 0.102: v9.58,7.1 9.48,7 9.48,5.93 8.72,5.17 8.09,5.17 7.37,4.46 7.37,3.4 7.85,2.92 11.73,2.92 12.46,2.19 12.46,1.61 v12.6,1.48
CLKIN
  Bottom 0.254: U5.23 23.64,19.89 24.03,19.51 24.03,15.33 18.39,15.33 17.38,14.32 X1.1 17.16,14.39 15.53,14.39 C3.1
CLKOUT  (via drill 0.2)
  Top 0.254: v22.39,13.11 22.4,13.1 23.36,13.1 JP3.1
  Bottom 0.254: X1.3 21.65,11.92 | U5.22 24.02,20.39 24.46,19.95 24.46,12.06 24.06,11.65 C4.1 21.51,11.65 X1.3 | v22.39,13.11 22.35,13.11 21.25,12.01 X1.3
CS  (via drill 0.2 pad 0.15)
  Top 0.102: U2.E3 13.3,31.55 v13.69,31.95 | v13.69,31.95
  Bottom 0.102: v13.69,31.95 13.69,31.61 13.93,31.38 16.53,31.38 18.83,33.68 22,33.68 CS.TP
  Bottom 0.152: U5.17 22.4,22.89 23.34,23.82 23.34,25.67 | 23.34,25.67 23.34,32.46 22.45,33.34 CS.TP | R31.1 23.14,25.48 23.34,25.67
  Bottom 0.254: U5.17 21.58,22.87
CUR_DETECT  (via drill 0.2)
  Top 0.102: U2.E7 13.3,28.11 12.68,27.49 12.68,20.34 11.25,18.92 11.25,13.55 13.02,11.79 v13.02,10.26
  Top 0.152: v19.19,9.98 19.5,10.29 R23.2
  Top 0.254: R24.1 R23.2
  Bottom 0.102: v13.02,10.26 13.12,10.16 19.01,10.16 v19.19,9.98
D+  (via drill 0.2)
  Top 0.102: U2.A4 9.95,30.75 | 5.61,29.39 5.43,29.21 5.43,26.23
  Top 0.127: 9.95,30.75 8.59,29.39 5.61,29.39 | 4.94,25.73 5.43,26.23
  Top 0.152: U7.3 7.71,5.08 8.75,6.12 v9.02,6.12 | v8.73,7.66 8.9,7.83 8.9,13.12 8.67,13.35 5.32,13.35 4.66,14.01 4.66,15.85 4.94,16.13 4.94,25.73 | U1.1 8.12,6.68 v7.55,6.12
  Bottom 0.152: v8.73,7.66 8.9,7.49 8.9,6.24 v9.02,6.12 8.9,6.23 7.67,6.23 v7.55,6.12
D-
  Top 0.102: U2.A5 9.97,29.94 | 6.02,28.83 5.97,28.78 5.97,25.42
  Top 0.127: 9.97,29.94 8.87,28.83 6.02,28.83 | 5.97,25.42 5.29,24.75
  Top 0.152: U7.2 7.06,5.18 7.25,5.37 7.57,5.37 8.84,6.64 8.84,7.17 | 5.29,24.75 5.29,16.02 4.96,15.69 4.96,14.14 5.45,13.66 8.98,13.66 9.22,13.42 9.22,13.03 9.22,7.43 9.2,7.43 8.94,7.17 8.84,7.17 | 8.84,7.17 8.54,7.17 8.43,7.28 U1.2
DIN  (via drill 0.2)
  Top 0.102: U2.E0 13.3,34.74 14.35,35.8 15.61,35.8 15.94,36.12 15.94,36.47 17.29,37.82 19.18,37.82 20.17,36.84 20.17,35.27 21.58,35.27 22.41,36.1 v22.54,36.1 22.55,36.11 22.84,36.11 23.65,35.3 JP3.19
  Bottom 0.102: v22.54,36.1 22.87,36.42 DIN.TP
  Bottom 0.152: U5.21 22.61,20.89 24.62,22.9 24.62,34.9 24.35,35.17 24.35,36.12 24.05,36.42 DIN.TP
DOUT  (via drill 0.2, 0.2 pad 0.15)
  Top 0.102: U2.F2 14.31,32.58 14.32,32.58 v14.49,32.75 | v22.23,35.26 22.24,35.26 22.68,34.82 22.68,33.74 23.66,32.76 JP3.17
  Bottom 0.102: v14.49,32.75 14.7,32.53 16.93,32.53 18.74,34.34 20.82,34.34 21.74,35.26 v22.23,35.26 22.47,35.5 23.02,35.5 DOUT.TP
  Bottom 0.152: U5.20 22.58,21.39 24.3,23.11 24.3,34.43 23.94,34.78 23.94,35.3 23.73,35.52 | 23.73,35.52 DOUT.TP | R30.1 23.78,35.52 23.73,35.52
DRDY  (via drill 0.2)
  Top 0.102: U2.D1 12.54,33.08 12.57,33.08 13.07,33.59 13.44,33.59 13.7,33.85 13.7,34.74 14.5,35.54 15.74,35.54 16.19,36 16.19,36.36 17.4,37.56 19.08,37.56 19.91,36.73 19.91,35.17 20.97,34.11 21.6,34.11 v21.64,34.14
  Bottom 0.102: v21.64,34.14 22.66,34.14 22.91,33.9 DRDY.TP
  Bottom 0.152: U5.18 22.39,22.39 23.65,23.66 23.65,33.16 22.96,33.85 DRDY.TP
GND  (via drill 0.2)  (35 unrouted)
  Top 0.102: U2.G0 14.9,34.37 15.01,34.48 | 15.01,34.48 15.12,34.59 15.94,34.59 16.95,35.61 16.95,36.02 17.49,36.56 v18.15,36.56 | v14.96,34.54 15.01,34.49 15.01,34.48
  Top 0.152: U6.8 15.41,1.1 15.73,1.1 v15.95,1.32 | 9.01,4.78 U7.5 9.01,5.26 9.26,5.51 v10.19,5.51 10.43,5.75 10.43,7.71 10.86,8.14 10.86,9.52 11.32,9.97 11.97,9.97 12.88,9.06 | C13.1 14.7,12.82 13.85,11.96 13.85,10.02 12.88,9.06 | LED3.C 21.76,39.24 v20.95,38.43 | v20.29,37.71 LED2.C | 13.23,2.37 U6.4 12.31,2.42 11.97,2.76 10.36,2.76 9.38,1.79 U7.MP2 | U6.15 14.41,5.24 15.83,6.66 R4.1 | R4.1 16.05,6.47 C10.1 16.07,5.56 18.06,5.56 18.5,5.12 | 18.5,5.12 18.59,5.03 18.59,4.25 R3.1 18.93,4.13 v19.63,4.13 19.68,4.18 | R1.1 12.5,5.9 11.92,5.9 C14.1 | R1.1 13.72,5.85 13.72,7.29 13.86,7.43 14.93,7.43 v15.09,7.26 15.11,7.26 15.71,6.66 R4.1 | R1.1 | U2.G4 U2.H4 | U6.6 14.41,0.9 v14.4,0.89 | 12.88,9.06 v16.49,9.06 | C31.1 5.78,6.15 5.78,6.73 C30.1 5.88,7.02 6.32,7.46 v6.79,7.46 7.06,7.46 7.38,7.79 U1.4 | 6.42,7.5 C26.1 C27.1 | 18.5,5.12 19.72,5.12 J1.1
  Top 0.254: U7.MP1 6.06,1.89 5.21,2.74 3.83,2.74 v3.1,3.47 | U3.2 14.7,14.1 14.7,13.87 | 14.7,13.87 C13.1 | 14.7,13.87 | v4.51,11.48 4.51,8.29 4.43,8.21 v4.43,8.12 | v7.68,1.37 8.11,1.79 U7.MP2 | C18.2 C19.1 3.32,6.32 C9.1 3.32,5.39 3.64,5.08 3.64,4.65 v3.79,4.5 | 13.87,18.47 13.4,18.01 C12.1 | 13.87,18.47 13.75,18.47 13.75,18.86 13.68,18.93 C15.1 | 13.87,18.47 R22.1 15.92,18.47 C23.1 | v22.39,17.29 22.62,17.52 JP3.5
  Top 0.305: U2.G5 U2.H6 | U2.G6 U2.H5 | U2.H6 16.3,28.55 v16.3,28.53 | v16.3,28.53 v16.31,28.53 15.93,28.53 15.79,28.38 | v16.3,28.53 | 15.79,28.38 15.75,28.34 U2.H7 | U2.H6 15.79,29.05 15.79,28.38
  Bottom 0.102: C8.2 17.84,26.73
  Bottom 0.152: U4.2 22.6,29.83 22.71,29.94 22.71,31.94 22.19,32.45 21.2,32.45 | v18.15,36.56 19.85,36.56 20.32,37.03 20.81,37.03 | 24.93,35.57 24.93,36.19 24.09,37.03 20.81,37.03 | 24.93,35.57 24.93,6.19 v24.35,5.61 | v20.29,37.71 v20.29,37.7 20.61,37.38 20.81,37.19 | v20.95,38.43 20.81,38.29 20.81,37.19 | 20.81,37.19 20.81,37.03 | 21.2,32.45 21.22,32.43 C7.2 | v16.3,28.53 16.3,30.35 18.4,32.45 21.2,32.45 | R30.2 24.93,35.57 | U5.25 20.12,17.29 v22.39,17.29 | X1.4 18.46,13.13 v20.04,13.13 20.06,13.13 X1.2 | v14.4,0.89 13.28,0.89 12.82,0.43 8.62,0.43 v7.68,1.37
  Bottom 0.254: 18.1,25.74 18.15,25.69 18.34,25.5 18.34,25.51 18.59,25.26 18.62,25.23 U5.13 18.62,21.61 17.74,20.74 | 18.1,25.74 18.1,26.49 C8.2 17.91,26.68 C5.1 17.91,25.94 18.1,25.74 | 17.74,20.74 12.7,15.7 10.36,15.7 9.86,15.19 9.86,11.51 9.67,11.33 4.66,11.33 v4.51,11.48 | U5.28 18.62,19.86 17.74,20.74
  other vias: 2.13,5.93 18.06,10.62 21.87,2.82 22.87,6.09 1.01,34.55 23.25,9.44 2.8,8.17 19.31,1.05 8.29,8.54 1.64,3.88
  pour Top: 1.46,-0.28 -0.01,1.19 -0.01,35.1 16.75,35.1 16.75,36.07 17.75,37.07 25.64,37.07 25.64,1.36 24,-0.28
  pour Bottom: -0.29,30.28 0.55,31.11 4.1,31.11 6.13,33.14 11.47,33.14 12.47,32.14 12.47,30.78 15.36,27.88 16.89,27.88 16.89,30.03 18.7,31.84 20.24,31.84 20.82,31.25 20.82,28.53 20.32,28.03 20.32,19.9 18.83,18.41 18.83,15.35 15.82,15.35 15.02,14.55 15.02,12.57 13.24,10.78 -0.29,10.78
  pour Bottom: 0.04,31.44 4.01,31.44 5.97,33.41 11.71,33.41 12.68,32.44 12.68,31.03 15.52,28.19 16.67,28.19 16.67,30.14 18.65,32.13 20.36,32.13 21.12,31.36 21.12,28.38 20.6,27.87 20.6,19.67 19.09,18.16 19.09,15.37 18.76,15.04 15.97,15.04 15.53,14.6 15.53,12.57 13.47,10.5 -0.23,10.5 -0.23,1.48 1.55,-0.3 24.02,-0.3 25.69,1.37 25.69,37.12 18.39,37.12 16.36,35.1 0.04,35.1
  cutout Bottom: 3.28,15.18 3.28,14.24 6.07,14.24 6.07,15.18
ILM
  Top 0.152: U6.12 17.29,3.92 R3.2
ISET
  Top 0.152: U6.16 13.91,5.34 14.05,5.48 14.05,6.41 R4.2
LED1
  Top 0.102: R5.2
  Top 0.152: R5.2 0.68,7.11 LED1.A
LED2
  Top 0.102: LED2.A 20.25,39.24 20.25,38.85 20.4,38.69 20.4,38.31 20.86,37.84 R26.2
LED3
  Top 0.102: R27.2 23.1,37.02 22.36,37.77 LED3.A
NFC1  (via drill 0.2)
  Top 0.102: U2.D2 v12.88,32.75
  Bottom 0.102: v12.88,32.75 13.61,33.47 17.11,33.47 18.48,34.84 20.61,34.84 21.66,35.89 21.66,36.34 21.5,36.5 20.58,36.5 19.91,35.84 17.47,35.84 17.34,35.97 17.34,36.9 17.78,37.33 17.78,38.11 NFC2.TP
NFC2  (via drill 0.2)
  Top 0.102: U2.E2 v13.67,32.73
  Bottom 0.102: NFC1.TP 18.55,37.68 18.55,37.03 17.88,37.03 17.6,36.75 17.6,36.11 17.61,36.1 19.81,36.1 20.46,36.75 21.79,36.75 22.03,36.51 22.03,35.91 20.71,34.59 18.64,34.59 16.94,32.9 15.02,32.9 14.71,33.21 14.15,33.21 v13.67,32.73
P2  (1 unrouted)
  Top 0.102: U2.F4 14.17,30.75 14.59,30.33 15.86,30.33 16.13,30.07 16.13,29.37 17,28.5 | JP3.14 17.82,27.68 17.03,28.47
P3
  Top 0.102: U2.H0 15.75,34.02 16.42,34.02 16.76,34.36 19.59,34.36 21.37,32.58 21.37,30.02 22.54,28.84 22.54,23.77 23.38,22.93 23.69,22.93 JP3.9
P5
  Top 0.102: U2.G7 14.9,27.99 15.27,27.62 15.75,27.62 16.07,27.3 16.07,26.51 16.3,26.28 16.3,24.08 17.79,22.6 JP3.10
P7
  Top 0.102: U2.B6 10.88,28.89 10.5,28.51 10.5,24.69 9.29,23.48 9.12,23.31 8.54,23.31 7.87,22.63 JP2.11
P8
  Top 0.102: U2.C7 11.7,27.95 11.66,27.91 11.66,24.7 10.14,23.18 10.14,19.85 8.69,18.41 8.69,15.85 7.86,15.01 JP2.5
P11
  Top 0.102: U2.D5 12.46,29.94 12.13,29.6 12.13,29.01 11.86,28.74 11.49,28.74 11.29,28.55 11.29,24.7 9.88,23.28 9.88,20.28 8.44,18.84 8.44,18.17 7.82,17.55 JP2.7
P12
  Top 0.102: U2.B7 10.89,24.68 9.62,23.41 9.62,21.84 7.88,20.09 JP2.9
P14
  Top 0.102: U2.C4 11.32,31.13 10.69,31.13 10.5,31.31 10.5,31.74 10.31,31.93 6.31,31.93 4.92,30.54 4.92,28.65 4.71,28.44 4.71,26.28 4.38,25.95 4.38,18.23 4.12,17.97 4.12,13.74 6.02,11.84 6.02,11 7.09,9.93 JP2.1
P15
  Top 0.102: U2.B3 10.88,31.81 10.45,32.24 10.45,32.5 10.22,32.74 9.98,32.74 9.08,33.63 6.06,33.63 4.66,32.22 4.66,28.76 4.45,28.55 4.45,26.38 4.13,26.05 4.13,18.34 3.39,17.61 3.39,15.71 3.11,15.43 3.11,11.07 1.97,9.93 JP2.2
P16  (via drill 0.2, 0.2 pad 0.15)
  Top 0.102: U2.D3 12.51,31.54 v12.89,31.92 v12.89,31.93 | R26.1 20.88,37.17 v20.88,36
  Bottom 0.102: v12.89,31.93 12.84,31.93 12.13,32.64 13.21,33.73 17,33.73 18.38,35.1 20.49,35.1 20.88,35.5 v20.88,36
P17
  Top 0.102: U2.A3 10.01,31.63 6.38,31.63 5.18,30.43 5.18,28.55 4.96,28.33 4.96,26.17 4.63,25.84 4.63,18.12 4.38,17.87 4.38,13.87 5.2,13.05 6.52,13.05 7.17,12.41 7.41,12.41 JP2.3
P19
  Top 0.102: U2.A2 9.19,32.35 | 9.19,32.35 9.18,32.35 | 9.19,32.35 7.92,32.35 JP2.19
P20
  Top 0.102: U2.C2 11.7,32.55 12.11,32.96 12.11,33.29 12.37,33.55 12.67,33.55 12.88,33.77 12.88,34.69 14.27,36.07 15.53,36.07 15.68,36.23 15.68,36.57 17.19,38.07 19.29,38.07 20.42,36.94 20.42,35.53 21.33,35.53 22.15,36.35 22.15,36.67 R27.1
P21
  Top 0.102: U2.C3 11.24,32 11.24,34.25 10.34,35.15 4.78,35.15 3.38,33.75 3.38,29.29 3.16,29.07 3.16,26.88 2.85,26.58 2.85,23.43 2.05,22.63 JP2.12
P22
  Top 0.102: U2.B2 10.88,32.6 10.5,32.98 10.5,33.27 10.22,33.55 9.96,33.55 9.37,34.14 5.81,34.14 4.14,32.47 4.14,28.97 3.95,28.77 3.95,26.59 3.62,26.27 3.62,18.6 2.88,17.87 2.88,15.92 1.97,15.01 JP2.6
P23
  Top 0.102: U2.F0 14.08,34.77 14.6,35.28 15.85,35.28 16.45,35.88 16.45,36.26 17.49,37.3 18.99,37.3 19.65,36.63 19.65,35.04 21.88,32.81 21.88,30.34 23.07,29.14 23.07,28.23 23.63,27.68 JP3.13
P24
  Top 0.102: U2.F1 14.23,33.28 14.28,33.28 14.59,33.6 15.04,33.6 15.31,33.86 15.31,34.24 15.41,34.33 16.37,34.33 16.65,34.61 17.49,34.61 JP3.20
P25
  Top 0.102: U2.A1 9.94,33.14 9.19,33.88 5.93,33.88 4.4,32.35 4.4,28.86 4.2,28.66 4.2,26.49 3.87,26.16 3.87,18.48 3.14,17.75 3.14,15.82 2.86,15.54 2.86,13.35 1.98,12.47 JP2.4
P26  (via drill 0.2)
  Top 0.102: U2.E6 12.94,28.79 12.94,28.11 12.42,27.59 12.42,20.46 10.99,19.03 10.99,11.25 10.36,10.61 v10.36,8.91 | v2.12,8.51 1.55,8.51 1.33,8.3 R5.1
  Bottom 0.102: v10.36,8.91 10.24,9.03 2.77,9.03 2.25,8.51 v2.12,8.51
P28
  Top 0.102: U2.H1 15.76,33.14 16.47,33.14 16.7,33.37 16.7,33.58 16.97,33.85 19.38,33.85 20.84,32.39 20.84,29.7 21.96,28.58 22.03,28.5 22.03,18.98 21.71,18.65 21.71,15.55 18.6,12.44 JP3.2
P29
  Top 0.102: U2.E4 13.37,30.75 13.78,31.16 16.86,31.16 17.81,30.22 JP3.16
P30
  Top 0.102: U2.G1 15.18,33.14 15.59,33.55 16.45,33.55 16.45,33.69 16.86,34.11 19.48,34.11 21.11,32.49 21.11,29.85 22.29,28.67 22.29,22.34 23.05,21.58 23.05,20.7 23.68,20.06 JP3.7
P31
  Top 0.102: U2.E5 13.58,29.94 13.94,30.3 14.23,30.3 14.49,30.03 14.49,29.05 14.85,28.69 15.04,28.69 15.25,28.48 15.25,28.01 15.39,27.87 15.86,27.87 16.32,27.41 16.32,26.65 17.83,25.14 JP3.12
P101
  Top 0.102: U2.A0 10.06,33.95 9.62,34.39 5.69,34.39 3.89,32.59 3.89,29.08 3.69,28.88 3.69,26.7 3.36,26.37 3.36,18.9 2.36,17.9 1.98,17.9 JP2.8
P104
  Top 0.102: U2.B0 10.88,34.24 10.22,34.9 4.89,34.9 3.63,33.64 3.63,29.18 3.44,28.99 3.44,26.8 3.11,26.47 3.11,21.21 1.99,20.09 JP2.10
P106
  Top 0.102: U2.E1 13.5,33.34 13.67,33.34 13.86,33.54 14.17,33.54 14.49,33.86 14.49,34.74 14.77,35.02 15.98,35.02 16.7,35.74 16.7,36.15 17.59,37.04 18.89,37.04 19.4,36.53 19.4,34.92 21.63,32.69 21.63,30.16 22.8,28.99 22.8,25.98 23.64,25.14 JP3.11
P107
  Top 0.102: U2.C0 11.7,34.16 10.45,35.41 4.68,35.41 3.12,33.85 3.12,29.41 2.89,29.18 2.89,26.98 2.59,26.68 2.59,25.76 2,25.17 JP2.14
P108  (via drill 0.2 pad 0.15)
  Top 0.102: U2.C5 11.7,29.98 11.37,30.31 9.91,30.31 8.71,29.11 5.79,29.11 5.7,29.02 5.7,25.83 v5.5,25.62 | JP2.13 7.08,25.17 6.25,24.34 5.86,24.34 v5.77,24.25
  Bottom 0.102: v5.77,24.25 5.49,24.53 v5.49,25.62 v5.5,25.62
P109
  Top 0.102: U2.C6 11.7,29.17 11.36,29.51 10.74,29.51 10.5,29.27 10.5,29.03 10.25,28.78 9.94,28.78 9.44,28.27 8.04,28.27 JP2.15
P110
  Top 0.102: U2.H2 15.74,32.35 15.75,32.35 16.94,32.35 17.76,32.35 JP3.18
P111
  Top 0.102: U2.G2 15.15,32.35 15.54,32.74 16.43,32.74 16.95,33.26 16.95,33.48 17.07,33.6 19.27,33.6 20.58,32.29 20.58,29.6 21.7,28.47 21.7,28.46 21.78,28.38 21.78,19.09 21.45,18.76 21.45,15.73 21.29,15.56 18.76,15.56 JP3.4
P113
  Top 0.102: U2.G3 15.28,31.92 20.04,31.92 20.3,31.65 20.3,27.46 20.79,26.98 20.79,19.48 20.47,19.16 20.47,17.13 20.25,16.91 18.78,16.91 JP3.6
P114
  Top 0.102: U2.H3 19.91,31.54 20.04,31.41 20.04,27.32 20.52,26.84 20.52,21.21 19.95,20.64 18.76,20.64 JP3.8
PGOOD  (via drill 0.2)
  Top 0.102: U2.D7 12.48,28.02 12.17,27.7 12.17,20.59 10.73,19.16 10.73,17.69 | v9.94,6.54 10.1,6.7 10.1,8.45 9.89,8.66 9.89,10.59 10.73,11.44 10.73,17.69 | R28.2 10.5,17.69 10.73,17.69
  Top 0.152: U6.7 14.91,0.74 16.07,0.74 16.45,1.12 v16.45,1.87
  Bottom 0.102: v9.94,6.54 9.88,6.47 9.88,5.93 8.85,4.9 8.2,4.9 7.64,4.33 7.64,3.52 7.98,3.18 12.1,3.18 12.9,2.38 12.9,1.96 13.1,1.77 15.68,1.77 15.94,2.03 16.45,2.03 v16.45,1.87
RESET  (via drill 0.2)
  Top 0.102: U2.B4 10.7,30.75 10.31,31.14 8.77,31.14 | 8.77,31.14 6.31,31.14 5.65,30.48 v5.65,30.21 v5.63,30.2 | v6.05,24.85 6.05,24.89 6.25,25.09 6.25,26.17 6.42,26.34 9.28,26.34 R2.1 | 8.77,31.14 8.14,30.51 7.73,30.51 JP2.17
  Bottom 0.102: v5.63,30.2 5.62,30.2 4.08,28.65 0.63,28.65 0.42,28.44 0.42,24.46 0.54,24.34 2.78,24.34 4.69,26.25 5.79,26.25 6.05,25.99 v6.05,24.85
SCLK  (via drill 0.2, 0.2 pad 0.15)
  Top 0.102: v14.48,31.95 14.08,31.56 U2.F3 | v22.11,34.61 22.41,34.31 22.41,31.45 23.65,30.22 JP3.15
  Bottom 0.102: v14.48,31.95 16.73,31.95 18.79,34.02 20.86,34.02 21.46,34.61 v22.11,34.61 23.26,34.61 SCLK.TP
  Bottom 0.152: U5.19 22.47,21.89 23.98,23.4 23.98,34.15 23.43,34.7 SCLK.TP
SWDCLK
  Top 0.102: U2.C1 11.7,33.45 12.05,33.8 12.05,34.17 10.56,35.66 4.57,35.66 3.01,34.1 | 3.01,34.1 2.97,34.06 | 3.01,34.1 2.85,33.94 2.85,32.07 2.73,31.95 2.12,31.95 1.8,31.64 1.8,30.42 JP2.18
SWDIO  (via drill 0.2 pad 0.15)
  Top 0.102: U2.B1 10.88,33.29 10.5,33.67 10.5,34.26 10.12,34.65 5.29,34.65 v4.41,33.77 | v2.29,31.45 2.32,31.47 2.69,31.47 2.87,31.3 2.87,29.51 2.6,29.25 2.6,28.31 2,27.71 JP2.16
  Bottom 0.102: v4.41,33.77 4.33,33.69 4.17,33.69 2.29,31.81 v2.29,31.45
SWO
  Top 0.102: U2.D0 12.48,34.1 10.67,35.92 4.44,35.92 2.59,34.06 2.59,33.31 2.08,32.79 JP2.20
SYNC/RESET  (via drill 0.2 pad 0.15)
  Top 0.102: U2.D4 12.85,31.12 12.87,31.12 12.87,31.13 v12.88,31.15
  Bottom 0.102: v12.88,31.15 13.02,31.01 16.56,31.01 18.58,33.02 21.31,33.02 SYNC.TP
  Bottom 0.152: U5.16 20.12,24.57 22.59,24.57 22.59,25.96 23.01,26.38 23.01,32.11 22.37,32.75 22.05,32.75 21.77,33.04 SYNC.TP
TS
  Top 0.152: U6.1 12.46,3.92 12.46,5.2 R1.2
VDD  (via drill 0.2)
  Top 0.102: 14.08,29.92 13.7,29.53 13.7,28.14 13.02,27.45 13.02,24.53 C22.2
  Top 0.152: 14.08,29.92 U2.F5 | v20.57,16.44 20.75,16.62 20.75,19.05 21.08,19.38 21.08,27.78 v20.89,27.97
  Top 0.254: 12.96,16.68 12.96,15.89 12.06,14.99 R25.2 | 13.8,16.71 U3.5 12.96,16.68 | C22.2 13.42,20.15 13.02,19.74 | C23.2 | C23.2 16.71,16.84 17.14,16.42 20.55,16.42 v20.57,16.44 | 13.02,19.74 12.37,19.1 C15.2 12.37,18.5 12.58,18.3 12.58,18.01 C12.2 12.57,18 12.57,16.68 12.96,16.68 | C23.2 16.71,18.72 15.69,19.74 13.02,19.74 | JP3.3 24.02,15.36 v23.35,16.02
  Bottom 0.152: SJ1.1 21.28,27.58 v20.89,27.97 21.28,27.58 21.28,26.44 22.04,25.68 R31.2
  Bottom 0.254: U5.26 19.62,16.84 20.04,16.42 20.55,16.42 v20.57,16.44 20.57,16.41 22.96,16.41 v23.35,16.02
VDDH
  Top 0.102: R2.2 9.44,24.91 8.61,24.08 6.26,24.08 5.73,23.56 5.73,16.05 5.24,15.56 5.24,14.27 5.54,13.98 6.52,13.98 | 6.52,13.98 6.25,14.25 6.25,23.35 6.47,23.57 9,23.57 10.24,24.81 10.24,26.92 10.1,27.06 U2.A7 | 6.52,13.98 8.84,13.98 R25.1
  Top 0.152: R28.1 9.37,17.18 9.17,16.99 R29.1 9.17,15.24 9.46,14.95 R25.1
VIN  (via drill 0.2)
  Top 0.254: U3.3 15.82,14.26 16.85,14.25 16.85,15.9 21.11,15.9 21.11,18.89 21.45,19.23 21.45,28.24 21.04,28.65 v20.76,28.65 | C13.2 13.83,12.9 U3.1 13.83,15.07 13.94,15.18 15.61,15.18 15.73,15.06 U3.3 | U3.3 15.73,12.74 15.04,12.05 S1.2 15.04,11.07
  Bottom 0.254: C7.1 21.87,30.8 U4.1 20.91,30.78 20.91,29.38 21.37,28.92 21.81,28.92 U4.3 21.85,28.65 v20.76,28.65
VSWITCH  (via drill 0.2)
  Top 0.152: v12.14,0.91 12.14,0.99 12.08,1.05 12.08,1.7 12.35,1.97 12.94,1.97 13.57,1.33 13.91,1.33 U6.5
  Top 0.254: S1.3 17.84,7.24 21.08,7.24 21.35,6.97 21.35,3.63 20.62,2.9 v19.01,2.9 18.76,3.15 17.51,3.15 17.26,2.9 C11.2 17.26,2.79 16.63,3.42 U6.11 | U6.10 17.05,2.92
  Bottom 0.152: v19.01,2.9 19.01,1.88 17.65,0.52 15.86,0.52 14.93,1.45 13.41,1.45 12.73,0.77 12.28,0.77 v12.14,0.91
XTAL1_1
  Top 0.152: U2.F6 14.08,29.04 14.47,28.66 14.47,27.97 15.32,27.12 X2.2
  Top 0.254: X2.2 15.3,26.7 15.73,26.27 C2.2
XTAL2_1
  Top 0.152: U2.F7 14.08,27.64 13.62,27.17 X2.1
  Top 0.254: X2.1 13.6,26.7 C1.2

### Text on the board
tPlace: BC840M | 24 | DIN | SWO | 19 | 110 | DOUT | RESET | SCLK | SWD / CLK | 29 | SWD / IO | 109 | 2 | 23 | 107 | 108 | 31 | 106 | 21 | 7 | 5 | 3 | 104 | 12 | 114 | 30 | 101 | 8 | 113 | GND | 22 | 11 | 111 | VDD | 25 | 17 | 28 | 15 | 14 | 8.192M
bPlace: TOP | BC840M + ADS131M08 / JOSHUA BREWSTER / JACOB TINKHAUSER / BOJAN JOVANOVICH / AGPL v3 LICENSE
tNames: R2 | S1
Measures: Notes: / - Minimize space without jeopardizing grounding for the external ADC / i.e. be keen with ground plane traces and electron flow. / - Break out all unused programmable pins plus ADC inputs. / ADC inputs may have to be a (CHEAP) SMT connector backside to minimize possible interference from the radio, / but let's just break them out first and test. Let's still ID a 16-20 pin connector.
Document: SWO | SWDCLK | RESET | SWDIO | GND | VDD
bDocu: GND | VDD | 8.192MHz